# EAGLE design BLE (EAGLE 6.1)
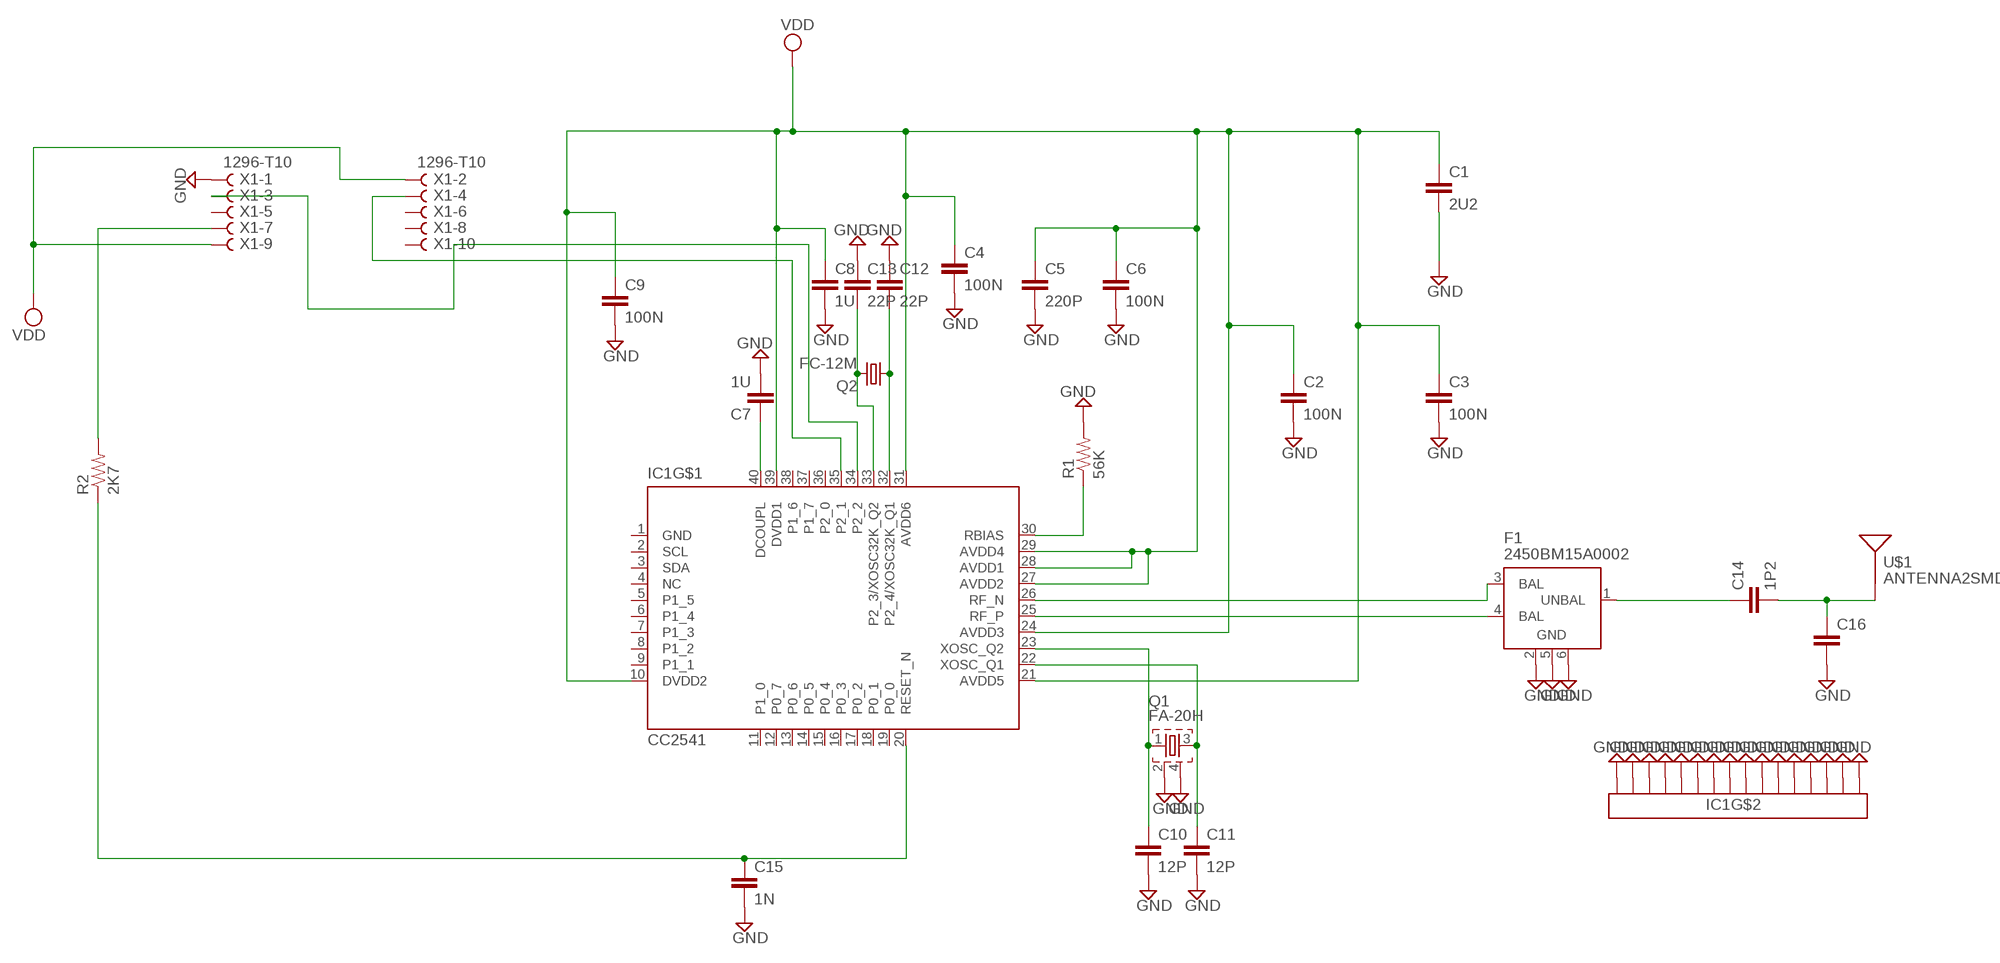
[diagram p0: schematic, sheet 1]

## Parts
C1  2U2  CAP0402-CAP  [0402-CAP]
C2  100N  CAP0402-CAP  [0402-CAP]
C3  100N  CAP0402-CAP  [0402-CAP]
C4  100N  CAP0402-CAP  [0402-CAP]
C5  220P  CAP0402-CAP  [0402-CAP]
C6  100N  CAP0402-CAP  [0402-CAP]
C7  1U  CAP0402-CAP  [0402-CAP]
C8  1U  CAP0402-CAP  [0402-CAP]
C9  100N  CAP0402-CAP  [0402-CAP]
C10  12P  CAP0402-CAP  [0402-CAP]
C11  12P  CAP0402-CAP  [0402-CAP]
C12  22P  CAP0402-CAP  [0402-CAP]
C13  22P  CAP0402-CAP  [0402-CAP]
C14  1P2  CAP0402-CAP  [0402-CAP]
C15  1N  CAP0402-CAP  [0402-CAP]
C16  CAP0402-CAP  [0402-CAP]
F1  2450BM15A0002  [2450BM15A0002]
IC1  CC2541  [QFN40-6X6]
Q1  FA-20H  [FA-20H]
Q2  FC-12M  [FC-12M]
R1  56K  RESISTOR0402-RES  [0402-RES]
R2  2K7  RESISTOR0402-RES  [0402-RES]
U$1  ANTENNA2SMD  [ANTENNA-CHIP2]
X1  1296-T10  [1296-10]

## Nets
GND: C1.2 C2.2 C3.2 C4.2 C5.2 C6.2 C7.2 C8.2 C9.2 C10.2 C11.2 C12.1 C13.1 C15.2 C16.2 F1.2(GND) F1.5(GND) F1.6(GND) IC1.EXP@1(EXP16) IC1.EXP@2(EXP16) IC1.EXP@3(EXP16) IC1.EXP@4(EXP16) IC1.EXP@5(EXP16) IC1.EXP@6(EXP16) IC1.EXP@7(EXP16) IC1.EXP@8(EXP16) IC1.EXP@9(EXP16) IC1.EXP@10(EXP16) IC1.EXP@11(EXP16) IC1.EXP@12(EXP16) IC1.EXP@13(EXP16) IC1.EXP@14(EXP16) IC1.EXP@15(EXP16) IC1.EXP@16(EXP16) Q1.2 Q1.4 R1.2 X1.1
N$1: IC1.30(RBIAS) R1.1
N$2: C7.1 IC1.40(DCOUPL)
N$3: C11.1 IC1.22(XOSC_Q1) Q1.3
N$4: C10.1 IC1.23(XOSC_Q2) Q1.1
N$5: C12.2 IC1.32(P2_4/XOSC32K_Q1) Q2.1
N$6: C13.2 IC1.33(P2_3/XOSC32K_Q2) Q2.2
N$7: F1.3(BAL) IC1.26(RF_N)
N$8: F1.4(BAL) IC1.25(RF_P)
N$9: C14.1 F1.1(UNBAL)
N$10: C14.2 C16.1 U$1.FEED(SIGNAL)
N$11: C15.1 IC1.20(RESET_N) R2.1
N$12: R2.2 X1.7
N$13: IC1.34(P2_2) X1.3
N$14: IC1.35(P2_1) X1.4
VDD: C1.1 C2.1 C3.1 C4.1 C5.1 C6.1 C8.1 C9.1 IC1.10(DVDD2) IC1.21(AVDD5) IC1.24(AVDD3) IC1.27(AVDD2) IC1.28(AVDD1) IC1.29(AVDD4) IC1.31(AVDD6) IC1.39(DVDD1) X1.2 X1.9
Unconnected: IC1.2(SCL) IC1.3(SDA) IC1.5(P1_5) IC1.6(P1_4) IC1.7(P1_3) IC1.8(P1_2) IC1.9(P1_1) IC1.11(P1_0) IC1.12(P0_7) IC1.13(P0_6) IC1.14(P0_5) IC1.15(P0_4) IC1.16(P0_3) IC1.17(P0_2) IC1.18(P0_1) IC1.19(P0_0) IC1.36(P2_0) IC1.37(P1_7) IC1.38(P1_6) X1.5 X1.6 X1.8 X1.10

## Power pins joined to a net without a drawn wire
GND: IC1.1(GND)
NC: IC1.4(NC)

## Library data of the parts
C1-C16 = SparkFun-Capacitors:CAP: Capacitor Standard 0603 ceramic capacitor, and 0.1" leaded capacitor.
F1 = johanson-technology:2450BM15A0002: 2.45 GHz Impedance Matched Balun-Filter For TI CC253X/CC2540 Chipset family Data sheet <http://www.johansontechnology.com/images/stories/ip/baluns/balun_filter_combo_matched_2450bm15a0002_v8.pdf>
IC1 = texas:CC2541: 2.4-GHz Bluetooth® low energy System-on-Chip Auto generated by make-symbol-device-package-bsdl.ulp Rev. 39 Source: cc2540.txt
Q1 = crystal:FA-: MHz RANGE CRYSTAL UNIT Source: Epson Toyocom
Q2 = crystal:FC-12M: kHz RANGE CRYSTAL UNIT LOW PROFILE SMD Source: Epson Toyocom FC-12M.pdf
R1 R2 = SparkFun-Resistors:RESISTOR: Resistor Basic schematic elements and footprints for 0603, 1206, and PTH resistors.
U$1 = SparkFun-RF:ANTENNA2: Chip antenna Single endded antenna. Common with smaller chip antennas. CHIP4 package is the GPS Chip Antenna SKU: GPS-08418. CHIP5 package is 2.4GHz chip antenna SKU: WRL-00144.
X1 = con-leotronics:1296-T10: 1.27mm SINGLE ROW FEMALE SOCKET Source: http://www.leotronics.co.uk/Conexcon/Data%20Sheets/sec.%20A/1296ing.pdf; OC_FARNELL: unknown; OC_NEWARK: unknown

## Board
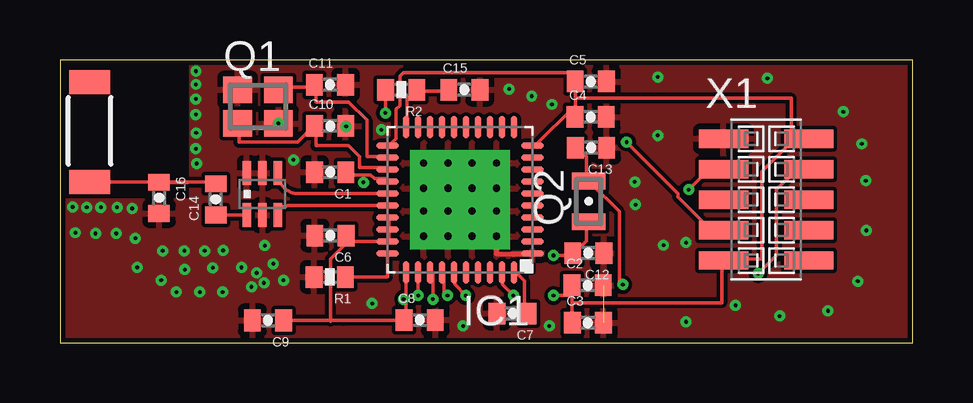
[diagram p1: board, top side]
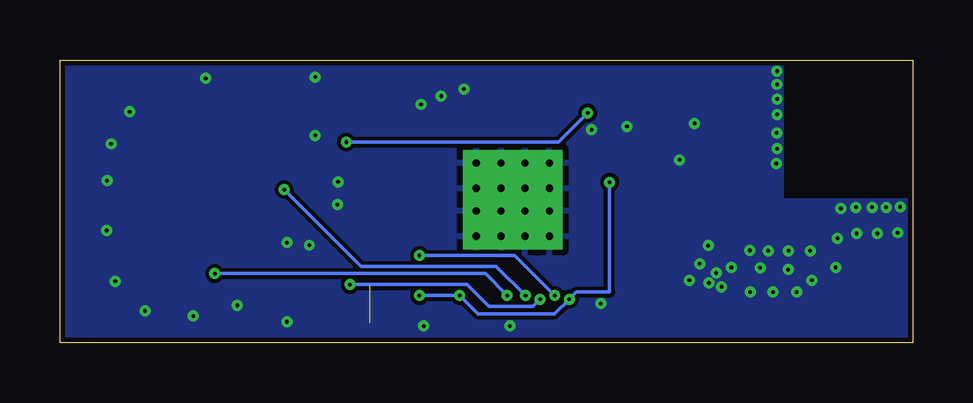
[diagram p2: board, bottom side, seen from below]

Size 35.56 x 11.81 mm. Coordinates in mm from the lower left corner, seen from the top.
Outline: 0,0 35.56,0 35.56,11.81 0,11.81 0,0
Copper layers (1*16): Top 0.035mm / dielectric 0.73mm / Bottom 0.035mm
Design rules: minimum track width 6mil, minimum drill 6mil, track to track 6mil, track to pad 6mil, pad to pad 6mil, via to via 6mil, smd to smd 6mil, copper to edge 8mil, drill to drill 6mil, minimum pad ring 6mil, minimum via ring 6mil, stop-mask expansion 4mil, vias tented up to drill 0mil, thermal gap 10mil

### Footprints (pad centres in the part's own frame; a part is rotated, then mirrored left to right if it is on the bottom)
0402-CAP = smd 0.7 x 0.9: 1 -0.65,0; 2 0.65,0
2450BM15A0002 = smd 0.35 x 1: 1 -0.65,-0.875; 2 0,-0.875; 3 0.65,-0.875; 4 0.65,0.875; 5 0,0.875; 6 -0.65,0.875
QFN40-6X6 = smd 0.95 x 0.28: 1 -3.025,2.25; 2 -3.025,1.75; 3 -3.025,1.25; 4 -3.025,0.75; 5 -3.025,0.25; 6 -3.025,-0.25; 7 -3.025,-0.75; 8 -3.025,-1.25; 9 -3.025,-1.75; 10 -3.025,-2.25; 21 3.025,-2.25; 22 3.025,-1.75; 23 3.025,-1.25; 24 3.025,-0.75; 25 3.025,-0.25; 26 3.025,0.25; 27 3.025,0.75; 28 3.025,1.25; 29 3.025,1.75; 30 3.025,2.25 | smd 0.28 x 0.95: 11 -2.25,-3.025; 12 -1.75,-3.025; 13 -1.25,-3.025; 14 -0.75,-3.025; 15 -0.25,-3.025; 16 0.25,-3.025; 17 0.75,-3.025; 18 1.25,-3.025; 19 1.75,-3.025; 20 2.25,-3.025; 31 2.25,3.025; 32 1.75,3.025; 33 1.25,3.025; 34 0.75,3.025; 35 0.25,3.025; 36 -0.25,3.025; 37 -0.75,3.025; 38 -1.25,3.025; 39 -1.75,3.025; 40 -2.25,3.025 | drill 0.3 pad 1.1 square: EXP@1 -1.525,1.525; EXP@2 -0.5,1.525; EXP@3 0.5,1.525; EXP@4 1.525,1.525; EXP@5 -1.525,0.475; EXP@6 -0.5,0.475; EXP@7 0.5,0.475; EXP@8 1.525,0.475; EXP@9 -1.525,-0.475; EXP@10 -0.5,-0.475; EXP@11 0.5,-0.475; EXP@12 1.525,-0.475; EXP@13 -1.525,-1.525; EXP@14 -0.5,-1.525; EXP@15 0.5,-1.525; EXP@16 1.525,-1.525
FA-20H = smd 1.2 x 1.1: 1 -0.85,-0.7; 2 0.85,-0.7; 3 0.85,0.7; 4 -0.85,0.7
FC-12M = smd 0.7 x 1.4: 1 -0.85,0; 2 0.85,0
0402-RES = smd 0.7 x 0.9: 1 -0.65,0; 2 0.65,0
ANTENNA-CHIP2 = smd 1.7 x 1: FEED 0,1.25; P$2 0,-2.921
1296-10 = smd 0.76 x 2.05: 1 -2.54,-1.78; 2 -2.54,1.78; 3 -1.27,-1.78; 4 -1.27,1.78; 5 0,-1.78; 6 0,1.78; 7 1.27,-1.78; 8 1.27,1.78; 9 2.54,-1.78; 10 2.54,1.78

### Placement (x,y rotation side)
C1  11.26,7.12 180 top
C2  22,2.41 0 top
C3  22.01,0.85 0 top
C4  22.12,9.43 0 top
C5  22.13,10.91 0 top
C6  11.27,4.48 180 top
C7  18.87,1.23 180 top
C8  15,0.96 0 top
C9  8.67,0.95 180 top
C10  11.26,9.06 0 top
C11  11.26,10.77 0 top
C12  22.02,3.76 180 top
C13  22.14,8.15 180 top
C14  6.49,5.99 90 top
C15  16.86,10.57 0 top
C16  4.13,6.06 270 top
F1  8.44,6.22 0 top
IC1  16.68,5.98 180 top
Q1  8.26,9.86 0 top
Q2  22.04,5.91 90 top
R1  11.25,2.75 180 top
R2  14.23,10.57 180 top
U$1  1.23,7.96 180 top
X1  29.44,5.98 270 top

### Tracks (layer width: path | path; a pad name or v marks a point on that pad's centre or on a via)
GND  (via drill 0.15)  (1 unrouted)
  Top 0.152: 9.14,8.69 Q1.2
  Top 0.203: IC1.EXP@1 18.2,3.72 IC1.1
  other vias: 1.49,4.57 19.67,10.3 13.01,1.65 16.81,0.71 20.4,0.71 26.1,0.88 28.17,1.57 24.92,8.66 24.92,11.1 5.67,10.79 9.73,7.64 18.72,10.6 20.51,9.96 9.11,9.16 0.53,5.68 1.12,5.66 1.7,5.66 2.38,5.66 3.01,5.62 5.69,7.49 5.66,8.11 5.68,8.77 5.66,9.54 5.66,10.18 5.67,11.34 0.64,4.6 2.35,4.57 3.14,4.37 3.22,3.15 4.28,3.85 5.19,3.85 6.03,3.85 6.8,3.86 7.57,3.15 6.37,3.14 5.2,3.06 4.22,2.62 4.85,2.13 5.83,2.13 6.78,2.13 7.98,2.34 8.51,2.51 8.54,4.06 8.2,2.93 8.89,3.31 9.32,2.62 23.96,6.73 24,5.77 26.1,4.19 25.16,4.08 30,1.13 32.01,1.34 33.26,2.58 33.61,4.7 33.6,6.77 33.43,8.31 32.66,9.65 29.49,11.04 13.4,8.9 11.93,9.03
  pour Top: 0,5.96 5.44,5.96 5.44,11.82 35.53,11.82 35.53,-0.03 0,-0.03 0,5.96
  pour Bottom: 0,5.96 5.44,5.96 5.44,11.82 35.53,11.82 35.53,-0.03 0,-0.03 0,5.96
N$1
  Top 0.152: R1.1 13.65,2.75 IC1.30
N$2
  Top 0.152: C7.1 19.51,1.37 19.36,1.52 19.36,2.59 19.05,2.9 IC1.40
N$3
  Top 0.152: Q1.3 9.14,10.67 10.52,10.67 C11.1 10.67,10.67 10.67,10.06 12.04,10.06 12.8,9.3 12.8,7.77 13.56,7.77 IC1.22
N$4
  Top 0.152: Q1.1 7.47,9.14 7.47,8.38 9.91,8.38 10.52,8.99 C10.1 10.67,8.99 10.67,8.23 12.04,8.23 12.5,7.77 12.5,7.32 13.56,7.32 IC1.23
N$5  (via drill 0.15)
  Top 0.152: Q2.1 21.95,5.03 21.95,4.27 21.49,3.81 C12.2 21.34,3.66 v20.57,3.66 | v14.94,1.98 14.94,2.9 IC1.32
  Bottom 0.152: v14.94,1.98 16.61,3.66 v20.57,3.66
N$6  (via drill 0.15)
  Top 0.152: C13.2 21.64,8.08 21.95,7.77 21.95,6.86 Q2.2 22.1,6.71 23.32,5.49 23.32,2.59 v23.47,2.44 | v15.54,1.83 15.54,2.9 IC1.33
  Bottom 0.152: v15.54,1.83 15.85,1.52 17.68,1.52 18.59,2.44 v23.47,2.44
N$7
  Top 0.152: F1.3 arc-90 9.48,5.73 IC1.26
N$8
  Top 0.152: F1.4 arc90 9.95,6.23 IC1.25
N$9
  Top 0.152: C14.1 arc90 C14.1 F1.1
N$10
  Top 0.152: U$1.FEED 5.66,6.71 | 5.66,6.71 6.21,6.71 C14.2 | C16.1 5.32,6.71 5.66,6.71
N$11
  Top 0.152: C15.1 16.15,10.52 14.94,10.52 R2.1 14.78,10.52 14.48,10.21 14.48,9.14 IC1.20
N$12  (via drill 0.15)
  Top 0.152: v13.56,9.6 13.56,10.52 R2.2 | v23.62,8.38 25.76,6.25 25.76,6.1 27.13,4.72 27.58,4.72 X1.7
  Bottom 0.152: v13.56,9.6 14.78,8.38 v23.62,8.38
N$13  (via drill 0.15)
  Top 0.152: v16.15,1.98 16,2.13 16,2.9 IC1.34 | v26.21,6.4 26.98,7.16 27.58,7.16 X1.3
  Bottom 0.152: v16.15,1.98 17.37,3.2 23.01,3.2 v26.21,6.4
N$14  (via drill 0.15)
  Top 0.152: v16.92,1.98 16.46,2.44 16.46,2.9 IC1.35 | v29.11,2.9 29.87,3.66 29.87,6.4 30.63,7.16 31.09,7.16 X1.4
  Bottom 0.152: v16.92,1.98 17.83,2.9 v29.11,2.9
VDD  (via drill 0.15)
  Top 0.152: IC1.31 14.43,1.83 | 14.43,1.83 14.43,0.95 | 14.43,0.95 11.8,0.94 11.28,0.94 | 11.28,0.94 C9.1 | 14.43,0.95 14.45,0.96 C8.1 | 13.72,4.72 13.72,5.18 IC1.27 | 13.72,4.72 IC1.28 13.72,4.72 | 13.72,4.72 13.72,4.27 IC1.29 12.18,4.23 arc-90 C6.1 12.04,4.27 11.28,3.5 11.28,0.91 11.28,0.94 | 12.65,7.01 12.95,7.01 13.11,6.86 13.56,6.86 IC1.24 | 12.65,7.01 12.04,7.01 C1.1 | 21.34,1.68 21.34,0.91 C3.1 | 21.34,1.68 21.34,1.98 | 21.34,1.98 21.34,2.29 C2.1 21.34,1.98 | v18.9,1.98 18.44,2.44 18.44,2.9 IC1.39 | 21.34,1.98 v20.57,1.98 | v12.65,6.71 12.65,7.01 | v14.33,1.83 14.43,1.83 | 14.43,1.83 14.48,1.83 14.43,1.83 | 21.49,10.21 21.49,10.82 C5.1 21.34,10.97 21.34,11.28 14.33,11.28 14.17,11.12 14.17,9.91 14.02,9.75 14.02,8.53 13.72,8.23 IC1.21 | 21.49,10.21 21.49,9.91 | 21.49,9.91 21.49,9.45 C4.1 | 21.49,9.91 19.81,8.23 IC1.10 | 30.48,8.38 29.26,7.16 29.26,3.5 27.74,3.5 X1.9 27.58,3.35 27.58,1.68 21.34,1.68 | 30.48,8.38 31.09,8.38 X1.2 30.48,8.38 | 21.49,10.21 30.48,10.21 30.48,8.38
  Bottom 0.152: v20.57,1.98 v18.9,1.98 18.14,1.22 14.94,1.22 v14.33,1.83 14.02,2.13 12.65,2.13 v12.65,6.71